# Altium schematic sheet Precision Full-Bridge Rectifier.SchDoc
size Letter; SheetNumber: 3; SheetTotal: 14
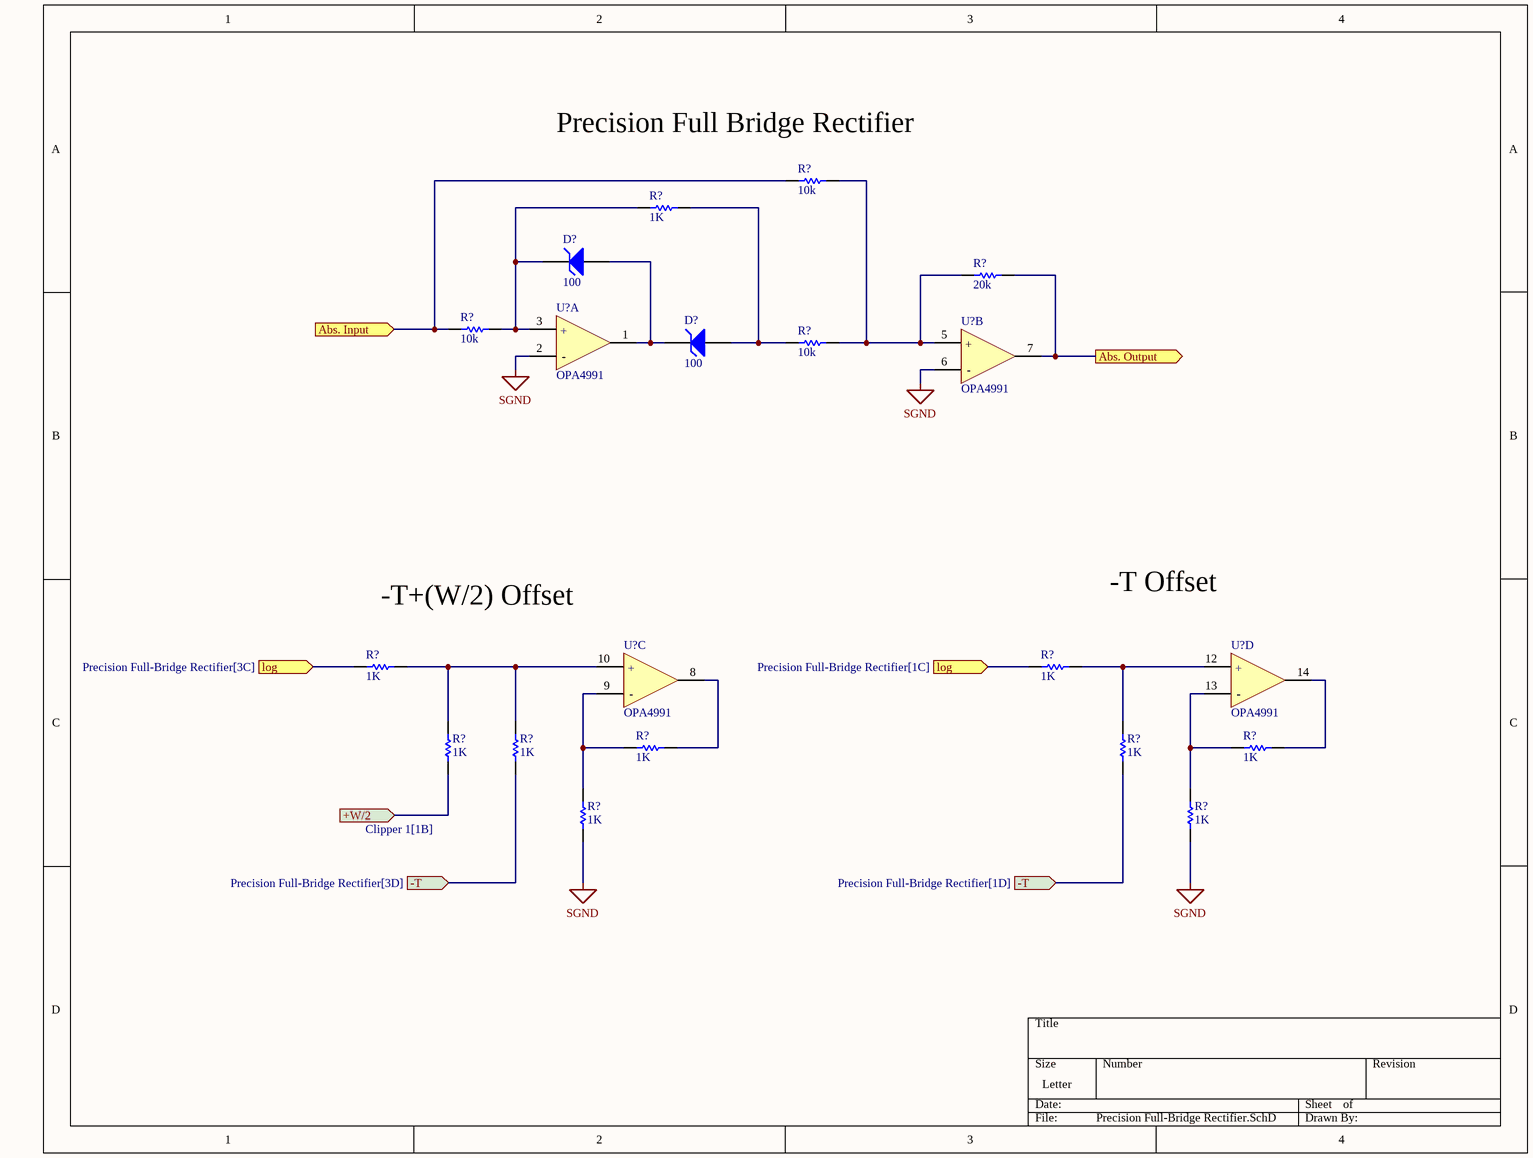
[diagram p0: Precision Full-Bridge Rectifier.SchDoc]

## Parts
(Parts that share a designator on the sheet are numbered #1, #2 ... from top to bottom, then left to right.)
D?#1  BV: 100  (hidden comment: Zener Diode)
D?#2  BV: 100  (hidden comment: Zener Diode)
R?#1  value 10k  (hidden comment: Resistor)
R?#2  value 1K  (hidden comment: Resistor)
R?#3  value 20k  (hidden comment: Resistor)
R?#4  value 10k  (hidden comment: Resistor)
R?#5  value 10k  (hidden comment: Resistor)
R?#6  value 1K  (hidden comment: Resistor)
R?#7  value 1K  (hidden comment: Resistor)
R?#8  value 1K  (hidden comment: Resistor)
R?#9  value 1K  (hidden comment: Resistor)
R?#10  value 1K  (hidden comment: Resistor)
R?#11  value 1K  (hidden comment: Resistor)
R?#12  value 1K  (hidden comment: Resistor)
R?#13  value 1K  (hidden comment: Resistor)
R?#14  value 1K  (hidden comment: Resistor)
U?#1  OPA4991  [FP-D0014A-IPC_B]  (part A of 5)
U?#2  OPA4991  [FP-D0014A-IPC_B]  (part B of 5)
U?#3  OPA4991  [FP-D0014A-IPC_B]  (part C of 5)
U?#4  OPA4991  [FP-D0014A-IPC_B]  (part D of 5)

## Ports
+W/2 (in, see Clipper 1[1B]), -T (in, see Precision Full-Bridge Rectifier[1D]), -T (in, see Precision Full-Bridge Rectifier[3D]), Abs. Input (in), Abs. Output (out), log (in, see Precision Full-Bridge Rectifier[1C]), log (in, see Precision Full-Bridge Rectifier[3C])

## Nets
SGND: R?#13.2 R?#14.2 U?#1.2(IN1-) U?#2.6(IN2-)
+W/2: R?#10.1 ; port +W/2
-T: R?#11.1 R?#12.1 ; port -T
Abs. Input: R?#1.1 R?#4.1 ; port Abs. Input
Abs. Output: R?#3.2 U?#2.7(OUT2) ; port Abs. Output
log: R?#6.1 R?#7.1 ; port log
NetD?#1_1: D?#1.1(A) D?#2.2(K) U?#1.1(OUT1)
NetD?#1_2: D?#1.2(K) R?#2.1 R?#4.2 U?#1.3(IN1+)
NetD?#2_1: D?#2.1(A) R?#2.2 R?#5.1
NetR?#1_2: R?#1.2 R?#3.1 R?#5.2 U?#2.5(IN2+)
NetR?#6_2: R?#6.2 R?#10.2 R?#11.2 U?#3.10(IN3+)
NetR?#7_2: R?#7.2 R?#12.2 U?#4.12(IN4+)
NetR?#8_1: R?#8.1 U?#3.8(OUT3)
NetR?#8_2: R?#8.2 R?#13.1 U?#3.9(IN3-)
NetR?#9_1: R?#9.1 U?#4.14(OUT4)
NetR?#9_2: R?#9.2 R?#14.1 U?#4.13(IN4-)

## Notes on the sheet
- (near R?#1) Precision Full Bridge Rectifier
- -T+(W/2) Offset
- -T Offset
- (in symbol OPA4991IDR, part A) +; -
- (in symbol OPA4991IDR, part B) +; -
- (in symbol OPA4991IDR, part C) +; -
- (in symbol OPA4991IDR, part D) +; -

## Library data of the parts
D?#1 D?#2 = Zener Diode: AF: 1; BV_MAX: 1e99; CJO: 0; EG: 1.11; FC: 0.5; IBV: 0.001; IS: 1e-14; MJSW: 0.33; NTUN: 30; TNOM: 27; XTI: 3; SimulationGenericComponent: True; CJP: 0; CTA: 0; CTP: 0; FCS: 0.5; FV_MAX: 1e99; IKF: 0; IKR: 0; ISR: 1e-14; JSW: 0; JTUN: 0; JTUNSW: 0; KEG: 1; KF: 0; LEVEL: 1; N: 1; NBV: 1; NR: 1; NS: 1; PHP: 1; RS: 0; TCV: 0; TLEV: 0; TLEVC: 0; TM1: 0; TM2: 0; TPB: 0; TPHP: 0; TRS: 0; TRS2: 0; TT: 0; TTT1: 0; TTT2: 0; VJ: 1; XTITUN: 3
R?#1-R?#14 = Resistor: TC1: 0; SimulationGenericComponent: True; TC2: 0
U?#1-U?#4 = OPA4991IDR: 40-V, DUAL 4.5MHZ, RAIL-TO-RAIL